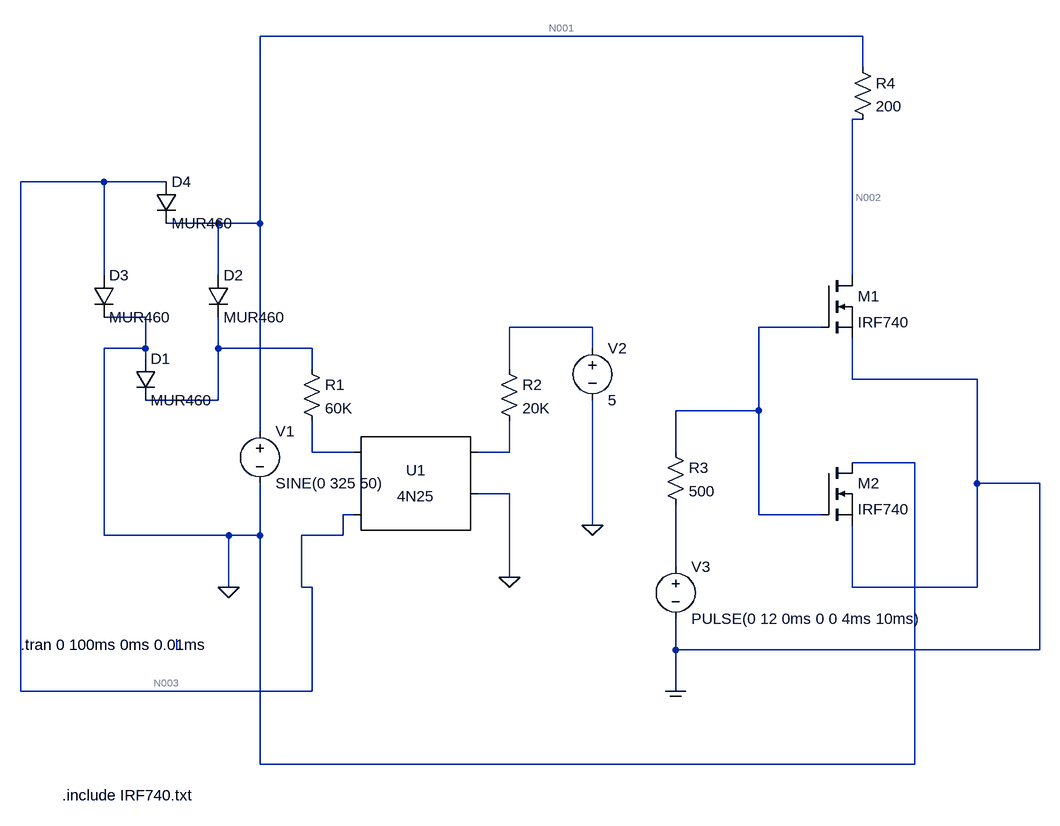
[diagram p0: schematic Zero_Crossing_Detector.asc]
Zero_Crossing_Detector.asc, the LTspice schematic file:
Version 4
SHEET 1 1084 688
WIRE 720 -496 -208 -496
WIRE 720 -448 720 -496
WIRE 720 -368 704 -368
WIRE -448 -272 -576 -272
WIRE -352 -272 -448 -272
WIRE -272 -208 -352 -208
WIRE -208 -208 -208 -496
WIRE -208 -208 -272 -208
WIRE -448 -128 -448 -272
WIRE -272 -128 -272 -208
WIRE 704 -128 704 -368
WIRE -384 -64 -448 -64
WIRE 304 -48 176 -48
WIRE 656 -48 560 -48
WIRE -384 -16 -384 -64
WIRE -384 -16 -448 -16
WIRE -272 -16 -272 -64
WIRE -128 -16 -272 -16
WIRE 304 -16 304 -48
WIRE -384 0 -384 -16
WIRE -128 16 -128 -16
WIRE 176 16 176 -48
WIRE 704 32 704 -32
WIRE 896 32 704 32
WIRE -272 64 -272 -16
WIRE -272 64 -384 64
WIRE 560 80 560 -48
WIRE 560 80 432 80
WIRE -208 112 -208 -208
WIRE -128 144 -128 96
WIRE -64 144 -128 144
WIRE 176 144 176 96
WIRE 176 144 128 144
WIRE 432 144 432 80
WIRE 800 160 704 160
WIRE 896 192 896 32
WIRE 992 192 896 192
WIRE 176 208 128 208
WIRE -64 240 -80 240
WIRE 560 240 560 80
WIRE 656 240 560 240
WIRE 304 256 304 64
WIRE -448 272 -448 -16
WIRE -256 272 -448 272
WIRE -208 272 -208 192
WIRE -208 272 -256 272
WIRE -80 272 -80 240
WIRE -80 272 -144 272
WIRE 432 320 432 224
WIRE 176 336 176 208
WIRE -256 352 -256 272
WIRE -144 352 -144 272
WIRE -128 352 -144 352
WIRE 704 352 704 256
WIRE 896 352 896 192
WIRE 896 352 704 352
WIRE -336 448 -336 432
WIRE 432 448 432 400
WIRE 992 448 992 192
WIRE 992 448 432 448
WIRE -576 512 -576 -272
WIRE -128 512 -128 352
WIRE -128 512 -576 512
WIRE 432 512 432 448
WIRE -208 624 -208 272
WIRE 800 624 800 160
WIRE 800 624 -208 624
FLAG 304 256 0
FLAG 176 336 0
FLAG -256 352 0
FLAG 432 512 COM
SYMBOL Optos\\4N25 32 208 R0
SYMATTR InstName U1
SYMBOL res -144 0 R0
SYMATTR InstName R1
SYMATTR Value 60K
SYMBOL res 160 0 R0
SYMATTR InstName R2
SYMATTR Value 20K
SYMBOL voltage -208 96 R0
WINDOW 123 0 0 Left 2
WINDOW 39 0 0 Left 2
SYMATTR InstName V1
SYMATTR Value SINE(0 325 50)
SYMBOL voltage 304 -32 R0
WINDOW 123 0 0 Left 2
WINDOW 39 24 124 Left 2
SYMATTR InstName V2
SYMATTR Value 5
SYMBOL diode -400 0 R0
SYMATTR InstName D1
SYMATTR Value MUR460
SYMBOL diode -288 -128 R0
SYMATTR InstName D2
SYMATTR Value MUR460
SYMBOL diode -464 -128 R0
SYMATTR InstName D3
SYMATTR Value MUR460
SYMBOL diode -368 -272 R0
SYMATTR InstName D4
SYMATTR Value MUR460
SYMBOL nmos 656 -128 R0
SYMATTR InstName M1
SYMATTR Value IRF740
SYMBOL nmos 656 160 R0
SYMATTR InstName M2
SYMATTR Value IRF740
SYMBOL voltage 432 304 R0
WINDOW 123 0 0 Left 2
WINDOW 39 0 0 Left 2
SYMATTR InstName V3
SYMATTR Value PULSE(0 12 0ms 0 0 4ms 10ms)
SYMBOL res 416 128 R0
SYMATTR InstName R3
SYMATTR Value 500
SYMBOL res 704 -464 R0
SYMATTR InstName R4
SYMATTR Value 200
TEXT -576 440 Left 2 !.tran 0 100ms 0ms 0.01ms
TEXT -512 672 Left 2 !.include IRF740.txt

The netlist it stands for:
* Zero_Crossing_Detector.asc
XU1 N007 N003 N008 0 NC_01 4N25
R1 N006 N007 60K
R2 N004 N008 20K
V1 N001 0 SINE(0 325 50)
V2 N004 0 5
D1 0 N006 MUR460
D2 N001 N006 MUR460
D3 N003 0 MUR460
D4 N003 N001 MUR460
M1 N002 N005 COM COM IRF740
M2 0 N005 COM COM IRF740
V3 N009 COM PULSE(0 12 0ms 0 0 4ms 10ms)
R3 N005 N009 500
R4 N001 N002 200
.model D D
.lib standard.dio
.model NMOS NMOS
.model PMOS PMOS
.lib standard.mos
.tran 0 100ms 0ms 0.01ms
.include IRF740.txt
.lib 4N25.sub
.backanno
.end

* Results of the author's LTspice run, read from the files saved beside the schematic
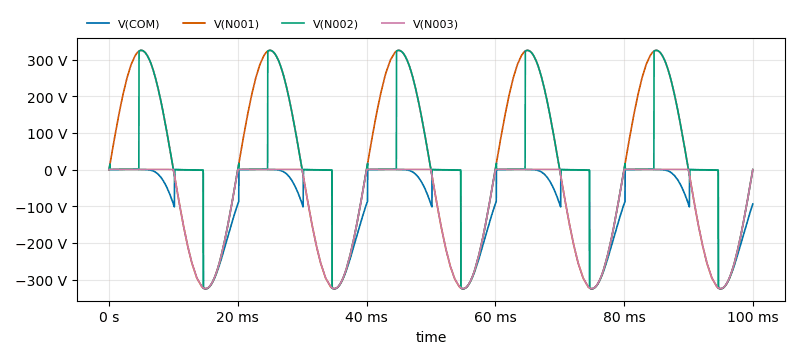
[diagram p1: Transient Analysis of Zero_Crossing_Detector.asc, plotted from the saved traces]
* Transient Analysis, 1 run:
*   V(COM): min -324.8 V, max 707.2 mV, average -70.64 V, rms 130.2 V, last -93.79 V
*   V(N001): min -325 V, max 325 V, average 63.97 mV, rms 229.7 V, last 0 V
*   V(N002): min -325 V, max 325 V, average 19.16 mV, rms 173.7 V, last -1.381 mV
*   V(N003): min -324.5 V, max 543.1 mV, average -102.7 V, rms 162.1 V, last -411.3 mV